# Altium project neck_ocb.PrjPcb
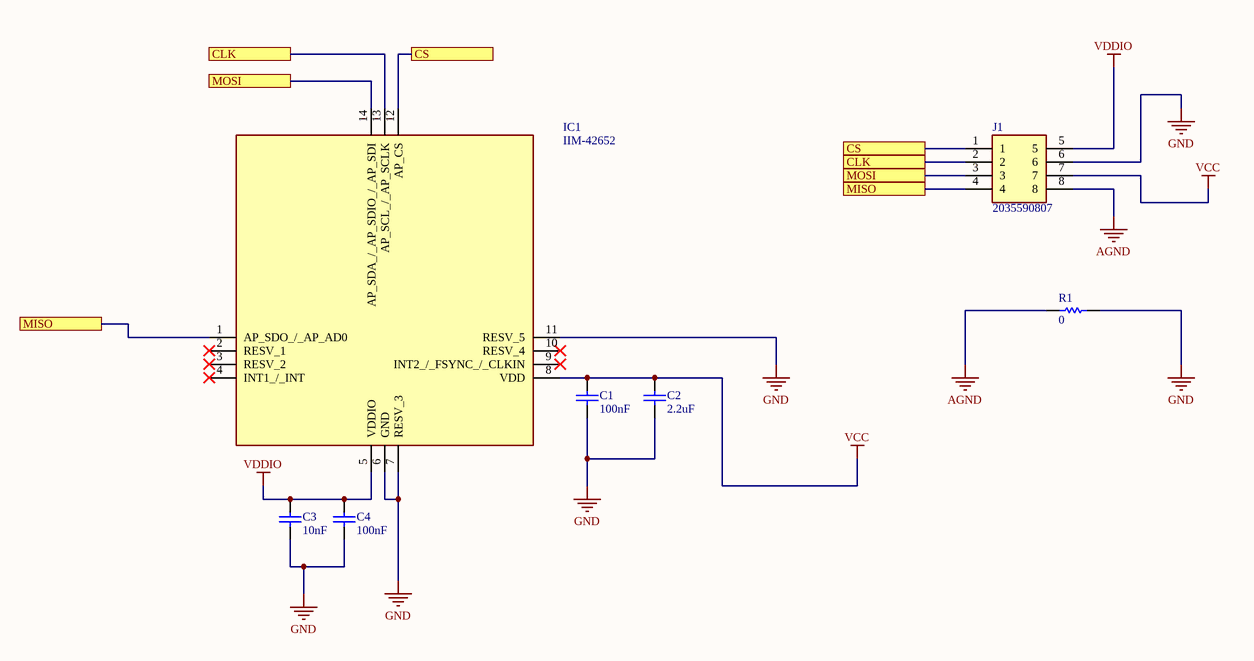
[diagram p0: neck.SchDoc]
1 sheet, 7 parts. Net scope: flat (ports and power ports of the same name join across sheets).
Board file: neck_v2.PcbDoc

## Sheet neck.SchDoc
size A4

### Parts
C1  100nF  [CAP_1005]
C2  2.2uF  [CAP_1005]
C3  10nF  [CAP_1005]
C4  100nF  [CAP_1005]
IC1  IIM-42652  [IIM42652]
J1  2035590807  [2035590807]
R1  0  [RES_1005]

### Ports
CLK, CS, MISO, MOSI

### Nets
AGND: J1.8 R1.1
GND: C1.1 C2.1 C3.1 C4.1 IC1.6(GND) IC1.7(RESV_3) IC1.11(RESV_5) J1.6 R1.2
VCC: C1.2 C2.2 IC1.8(VDD) J1.7
VDDIO: C3.2 C4.2 IC1.5(VDDIO) J1.5
NetIC1_1: IC1.1(AP_SDO_/_AP_AD0) J1.4 ; port MISO
NetIC1_12: IC1.12(AP_CS) J1.1 ; port CS
NetIC1_13: IC1.13(AP_SCL_/_AP_SCLK) J1.2 ; port CLK
NetIC1_14: IC1.14(AP_SDA_/_AP_SDIO_/_AP_SDI) J1.3 ; port MOSI

Not connected (* = marked no-connect by the designer): IC1 2(RESV_1)* 3(RESV_2)* 4(INT1_/_INT)* 9(INT2_/_FSYNC_/_CLKIN)* 10(RESV_4)*

### Library data of the parts
C1 C4 = CAP 1005: 1005(Metric) smd ceramic capacitor; Case Code (Metric): 1005; Case Code (Imperial): 0402; Value: 100nF
C2 C3 = CAP 1005: 1005(Metric) smd ceramic capacitor; Value: 100nF; Case Code (Metric): 1005; Case Code (Imperial): 0402
IC1 = IIM-42652: Integrated Circuit; Manufacturer_Name: TDK; Datasheet Link: https://product.tdk.com/system/files/dam/doc/product/sensor/mortion-inertial/imu/data_sheet/ds-000401-iim-42652.pdf; Height: 0.97mm; Manufacturer_Part_Number: IIM-42652; Mouser Part Number: 410-IIM-42652; Mouser Price/Stock: https://www.mouser.co.uk/ProductDetail/TDK-InvenSense/IIM-42652?qs=CiayqK2gdcJdwMEsK7YW9Q%3D%3D; Arrow Part Number: IIM-42652; Arrow Price/Stock: https://www.arrow.com/en/products/iim-42652/invensense?region=nac
J1 = 2035590807: Connector; Manufacturer_Name: Molex; Datasheet Link: https://www.molex.com/pdm_docs/sd/2035590207_sd.pdf; Height: 3.2mm; Manufacturer_Part_Number: 2035590807
R1 = RES 1005: 1005(Metric) smd resistor; Value: 10k; Case Code (Imperial): 0402; Case Code (Metric): 1005